# EAGLE design SurfaceEEG_V1.4 (EAGLE 7.7.0)
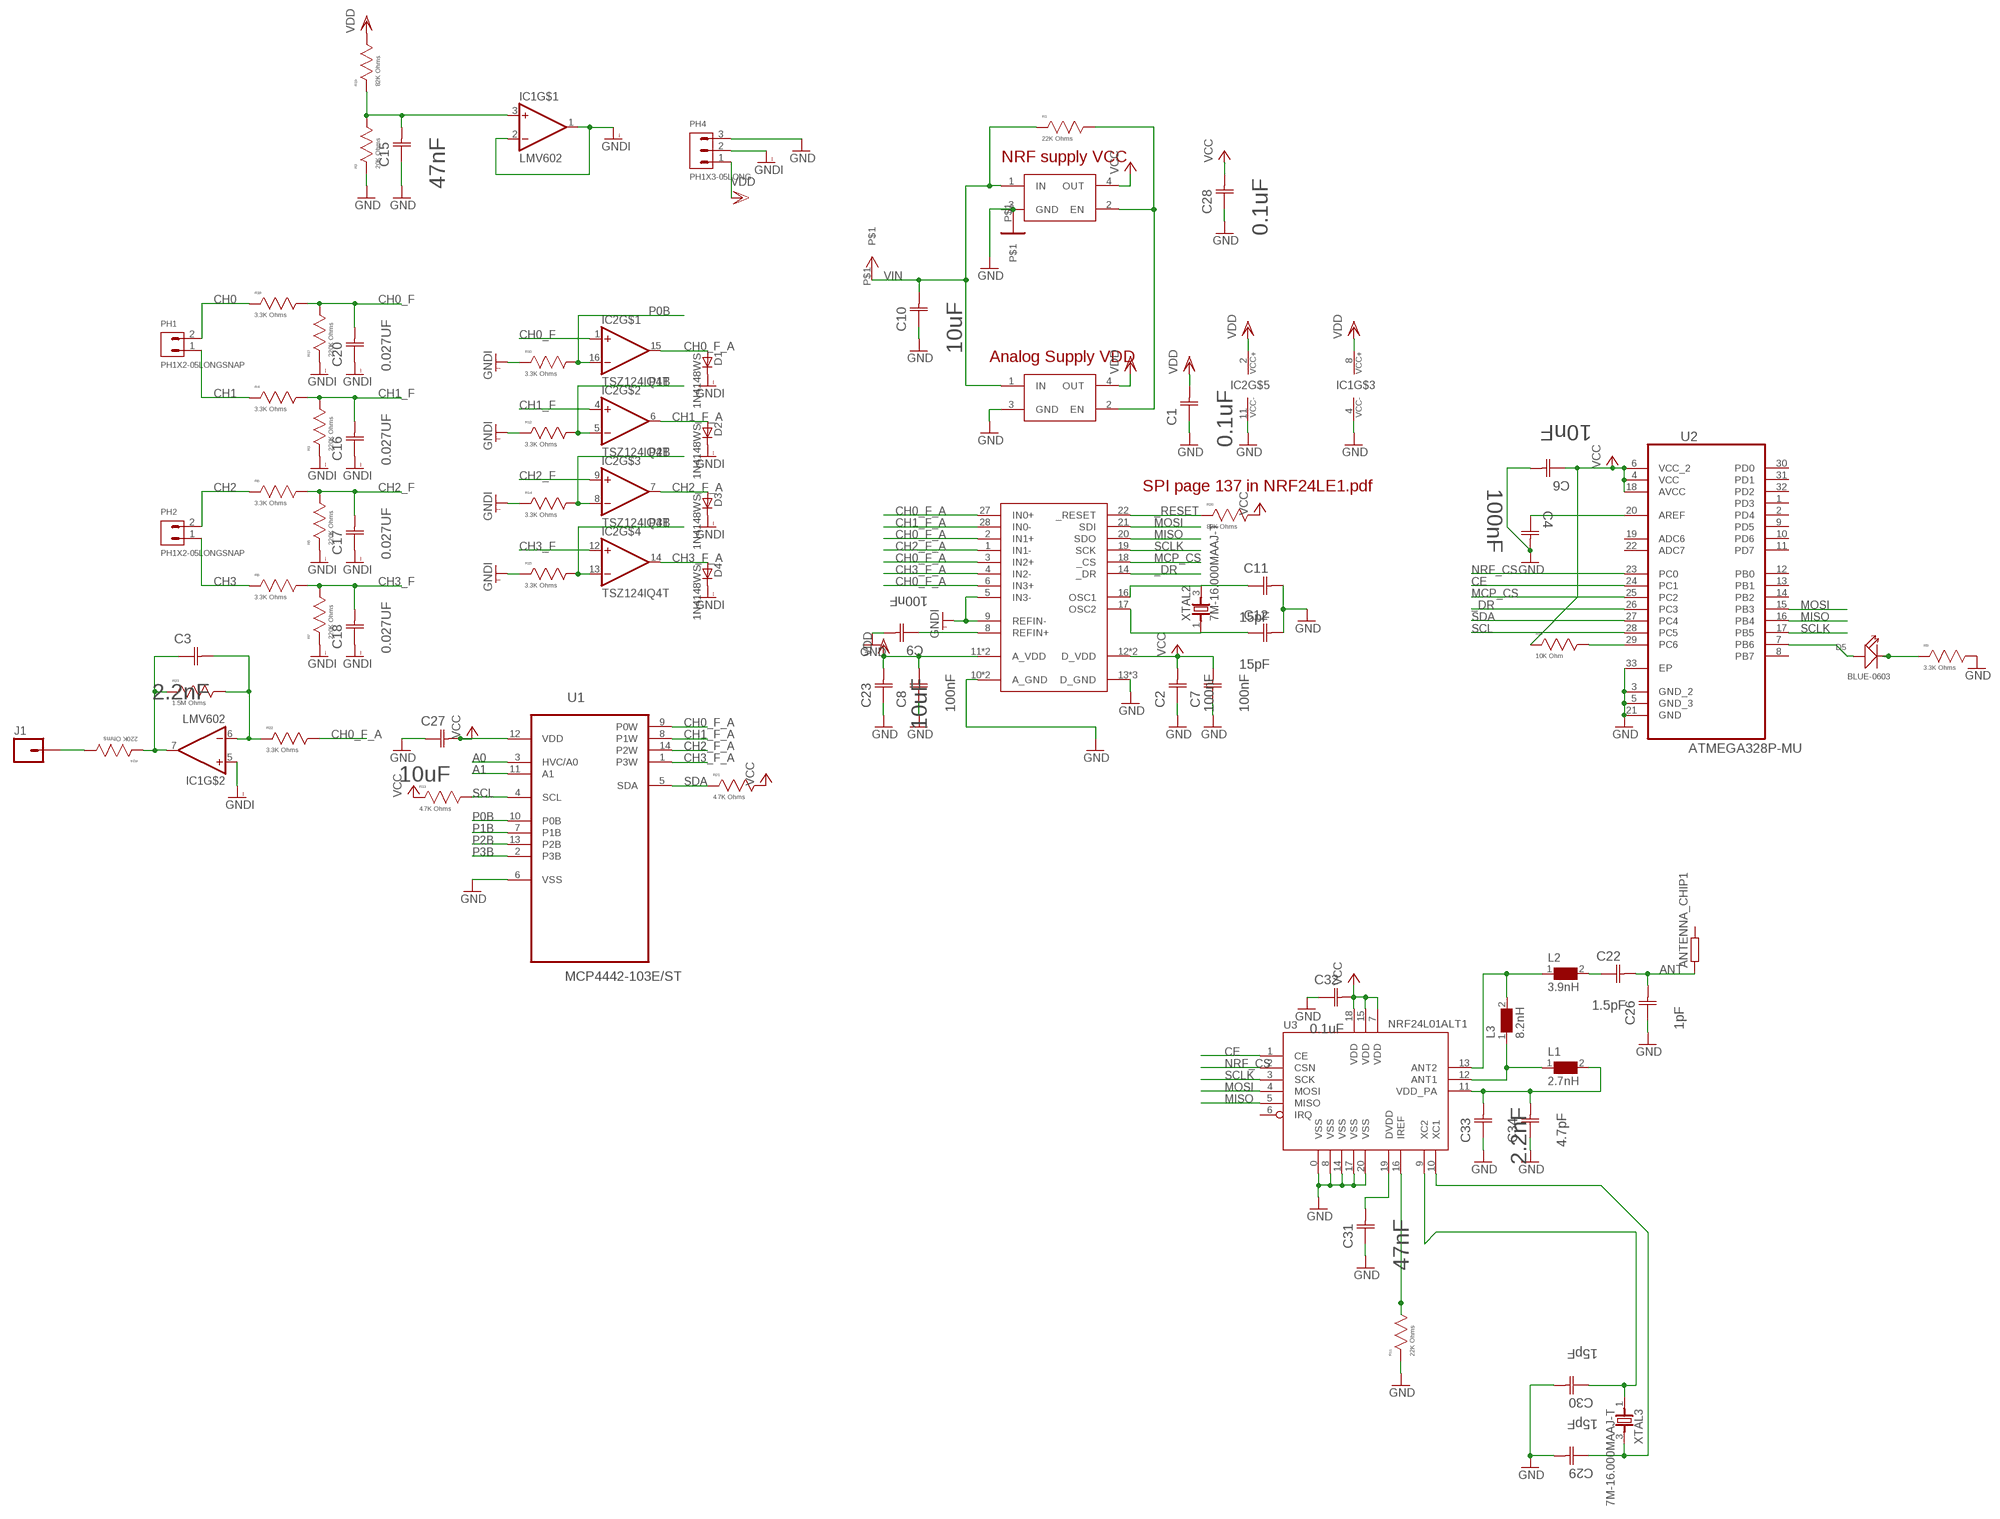
[diagram p0: schematic, sheet 1]

## Parts
ANTENNA_CHIP1  R0805  [R0805]
C1  0.1uF  C0603C104K5RAC-TU  [CAPC1608X85N]
C2  100nF  06033C104JAT2A  [CAPC1608X90N]
C3  2.2nF  C0402C222K5RACTU  [CAPC1005X60N]
C4  100nF  C0603C104K4RACTU  [CAPC1608X85N]
C6  10nF  C0603C103J3GACTU  [CAPC1608X85N]
C7  100nF  06033C104JAT2A  [CAPC1608X90N]
C8  100nF  06033C104JAT2A  [CAPC1608X90N]
C9  100nF  06033C104JAT2A  [CAPC1608X90N]
C10  10uF  C0603C106M9PACTU  [CAPC1608X85N]
C11  15pF  UQCL2A150JAT2A/500  [CAPC1005X60N]
C12  15pF  UQCL2A150JAT2A/500  [CAPC1005X60N]
C15  47nF  C0603C473K1RACTU  [CAPC1608X85N]
C16  0.027UF  0603YC273JAT2A  [CAPC1608X90N]
C17  0.027UF  0603YC273JAT2A  [CAPC1608X90N]
C18  0.027UF  0603YC273JAT2A  [CAPC1608X90N]
C20  0.027UF  0603YC273JAT2A  [CAPC1608X90N]
C22  1.5pF  UQCL2A1R5BAT2A/500  [CAPC1005X60N]
C23  10uF  C0603C106M9PACTU  [CAPC1608X85N]
C26  1pF  UQCL2A1R0BAT2A/500  [CAPC1005X60N]
C27  10uF  C0603C106M9PACTU  [CAPC1608X85N]
C28  0.1uF  C0603C104K5RAC-TU  [CAPC1608X85N]
C29  15pF  UQCL2A150JAT2A/500  [CAPC1005X60N]
C30  15pF  UQCL2A150JAT2A/500  [CAPC1005X60N]
C31  47nF  C0603C473K1RACTU  [CAPC1608X85N]
C32  0.1uF  04023C104KAT2A  [CAPC1005X60N]
C33  2.2nF  C0402C222K5RACTU  [CAPC1005X60N]
C34  4.7pF  UQCL2A4R7CAT2A/500  [CAPC1005X60N]
D1  1N4148WS  [SOD323F]
D2  1N4148WS  [SOD323F]
D3  1N4148WS  [SOD323F]
D4  1N4148WS  [SOD323F]
D5  BLUE-0603  SMD-LED-CLEAR-BLUE(0603)  [LED-0603]
IC1  LMV602  [VSSOP8]
IC2  TSZ124IQ4T  [QFN16]
J1  M01SMD-4.5X1.5  [PAD-1.5X4.5]
L1  2.7nH  WE-KI-744765027A_0402A  [WE-KI_0402A]
L2  3.9nH  WE-KI-744765039A_0402A  [WE-KI_0402A]
L3  8.2nH  WE-KI-744765082A_0402A  [WE-KI_0402A]
PH1  PH1X2-05LONGSNAP  [PHLS005-1-2]
PH2  PH1X2-05LONGSNAP  [PHLS005-1-2]
PH4  PH1X3-05LONG  [PHL005-1-3]
R1  22K Ohms  RC0603FR-0722KL  [RESC1608X60N]
R2  20K Ohms  RC0603FR-0720KL  [RESC1608X60N]
R3  220K Ohms  RC0603FR-07220KL  [RESC1608X60N]
R4  3.3K Ohms  RC0603FR-073K3L  [RESC1608X60N]
R5  220K Ohms  RC0603FR-07220KL  [RESC1608X60N]
R6  3.3K Ohms  RC0603FR-073K3L  [RESC1608X60N]
R7  220K Ohms  RC0603FR-07220KL  [RESC1608X60N]
R8  3.3K Ohms  RC0603FR-073K3L  [RESC1608X60N]
R9  3.3K Ohms  RC0603FR-073K3L  [RESC1608X60N]
R10  3.3K Ohms  RC0603FR-073K3L  [RESC1608X60N]
R11  22K Ohms  RC0603FR-0722KL  [RESC1608X60N]
R12  3.3K Ohms  RC0603FR-073K3L  [RESC1608X60N]
R13  4.7K Ohms  9C04021A4701JLHF3  [RESC1005X40N]
R14  3.3K Ohms  RC0603FR-073K3L  [RESC1608X60N]
R15  3.3K Ohms  RC0603FR-073K3L  [RESC1608X60N]
R16  10K Ohm  9C06031A1002JLHFT  [RESC1608X60N]
R17  220K Ohms  RC0603FR-07220KL  [RESC1608X60N]
R18  3.3K Ohms  RC0603FR-073K3L  [RESC1608X60N]
R19  82K Ohms  RT0603FRE0782KL  [RESC1608X60N]
R20  82K Ohms  RT0603FRE0782KL  [RESC1608X60N]
R21  4.7K Ohms  9C04021A4701JLHF3  [RESC1005X40N]
R22  3.3K Ohms  RC0603FR-073K3L  [RESC1608X60N]
R23  1.5M Ohms  RC0603FR-071M5L  [RESC1608X60N]
R24  220K Ohms  RC0603FR-07220KL  [RESC1608X60N]
U1  MCP4442-103E/ST  [SOP65P640X120-14N]
U2  ATMEGA328P-MU  [QFN50P500X500X100-33N]
U3  NRF24L01ALT1  [QFN20_ALT1]
U$1  NCP103  [UDFN4-1*1]
U$2  NCP103  [UDFN4-1*1]
U$3  MCP3912  [QFN28]
U$4  VCC  [VCC-PAD]
U$5  GND  [GND-PAD]
XTAL2  7M-16.000MAAJ-T  [TXC_7M-16.000MAAJ-T]
XTAL3  7M-16.000MAAJ-T  [TXC_7M-16.000MAAJ-T]

## Nets
_DR: U2.26(PC3) U$3.14(_DR)
_RESET: R20.2(R2) U$3.22(_RESET)
A0: U1.3(HVC/A0)
A1: U1.11(A1)
ANT: ANTENNA_CHIP1.1 C22.1(C2) C26.1(C2)
ANT1: L1.1 L3.1 U3.12(ANT1)
ANT2: L2.1 L3.2 U3.13(ANT2)
CE: U2.24(PC1) U3.1(CE)
CH0: PH1.2 R18.2(R2)
CH0_F: C20.2(C2) IC2.1(IN+) R17.1(R1) R18.1(R1)
CH0_F_A: D1.A IC2.15(OUT) R22.1(R1) U1.9(P0W) U$3.2(IN1+) U$3.3(IN2+) U$3.6(IN3+) U$3.27(IN0+)
CH1: PH1.1 R4.2(R2)
CH1_F: C16.2(C2) IC2.4(IN+) R3.1(R1) R4.1(R1)
CH1_F_A: D2.A IC2.6(OUT) U1.8(P1W) U$3.28(IN0-)
CH2: PH2.2 R6.2(R2)
CH2_F: C17.2(C2) IC2.9(IN+) R5.1(R1) R6.1(R1)
CH2_F_A: D3.A IC2.7(OUT) U1.14(P2W) U$3.1(IN1-)
CH3: PH2.1 R8.2(R2)
CH3_F: C18.2(C2) IC2.12(IN+) R7.1(R1) R8.1(R1)
CH3_F_A: D4.A IC2.14(OUT) U1.1(P3W) U$3.4(IN2-)
GND: C1.1(C1) C2.1(C1) C4.2(C2) C6.2(C2) C7.1(C1) C8.1(C1) C9.2(C2) C10.1(C1) C11.1(C2) C12.1(C2) C15.1(C1) C23.1(C1) C26.2(C1) C27.1(C1) C28.1(C1) C29.1(C2) C30.1(C2) C31.1(C1) C32.2(C1) C33.1(C1) C34.2(C1) IC1.4(VCC-) IC2.11(VCC-) PH4.3 R2.2(R2) R9.1(R1) R11.2(R2) U1.6(VSS) U2.3(GND_2) U2.5(GND_3) U2.21(GND) U2.33(EP) U3.0(VSS) U3.8(VSS) U3.14(VSS) U3.17(VSS) U3.20(VSS) U$1.3(GND) U$2.3(GND) U$3.10(A_GND) U$3.13(D_GND) U$3.15(D_GND) U$3.23(D_GND) U$3.26(A_GND) U$5.P$1
GNDI: C16.1(C1) C17.1(C1) C18.1(C1) C20.1(C1) D1.C D2.C D3.C D4.C IC1.1(OUT) IC1.2(IN-) IC1.5(IN+) PH4.2 R3.2(R2) R5.2(R2) R7.2(R2) R10.2(R2) R12.2(R2) R14.2(R2) R15.2(R2) R17.2(R2) U$3.5(IN3-) U$3.9(REFIN-)
MCP_CS: U2.25(PC2) U$3.18(_CS)
MISO: U2.16(PB4) U3.5(MISO) U$3.20(SDO)
MOSI: U2.15(PB3) U3.4(MOSI) U$3.21(SDI)
N$1: D5.+ U2.7(PB6)
N$2: D5.- R9.2(R2)
N$3: C3.2(C2) IC1.6(IN-) R22.2(R2) R23.1(R1)
N$5: R1.1(R1) U$1.2(EN) U$2.2(EN)
N$6: C3.1(C1) IC1.7(OUT) R23.2(R2) R24.2(R2)
N$7: C4.1(C1) U2.20(AREF)
N$8: C30.2(C1) U3.9(XC2) XTAL3.1
N$9: C29.2(C1) U3.10(XC1) XTAL3.3
N$10: J1.P$1 R24.1(R1)
N$12: C9.1(C1) U$3.8(REFIN+)
N$13: C22.2(C1) L2.2
N$14: C11.2(C1) U$3.16(OSC1) XTAL2.3
N$15: C12.2(C1) U$3.17(OSC2) XTAL2.1
N$16: C33.2(C2) C34.1(C2) L1.2 U3.11(VDD_PA)
N$18: C15.2(C2) IC1.3(IN+) R2.1(R1) R19.2(R2)
N$19: R11.1(R1) U3.16(IREF)
N$20: C31.2(C2) U3.19(DVDD)
NRF_CS: U2.23(PC0) U3.2(CSN)
P0B: IC2.16(IN-) R10.1(R1) U1.10(P0B)
P1B: IC2.5(IN-) R12.1(R1) U1.7(P1B)
P2B: IC2.8(IN-) R14.1(R1) U1.13(P2B)
P3B: IC2.13(IN-) R15.1(R1) U1.2(P3B)
RESET: R16.1(R1) U2.29(PC6)
SCL: R13.1(R1) U1.4(SCL) U2.28(PC5)
SCLK: U2.17(PB5) U3.3(SCK) U$3.19(SCK)
SDA: R21.2(R2) U1.5(SDA) U2.27(PC4)
VCC: C2.2(C2) C6.1(C1) C7.2(C2) C27.2(C2) C28.2(C2) C32.1(C2) R13.2(R2) R16.2(R2) R20.1(R1) R21.1(R1) U1.12(VDD) U2.4(VCC) U2.6(VCC_2) U2.18(AVCC) U3.7(VDD) U3.15(VDD) U3.18(VDD) U$1.4(OUT) U$3.12(D_VDD) U$3.24(D_VDD)
VDD: C1.2(C2) C8.2(C2) C23.2(C2) IC1.8(VCC+) IC2.2(VCC+) PH4.1 R19.1(R1) U$2.4(OUT) U$3.11(A_VDD) U$3.25(A_VDD)
VIN: C10.2(C2) R1.2(R2) U$1.1(IN) U$2.1(IN) U$4.P$1
Unconnected: ANTENNA_CHIP1.2 U2.1(PD3) U2.2(PD4) U2.8(PB7) U2.9(PD5) U2.10(PD6) U2.11(PD7) U2.12(PB0) U2.13(PB1) U2.14(PB2) U2.19(ADC6) U2.22(ADC7) U2.30(PD0) U2.31(PD1) U2.32(PD2) U3.6(IRQ)

## Notes on the sheet
- NRF supply VCC
- Analog Supply VDD
- SPI page 137 in NRF24LE1.pdf

## Library data of the parts
ANTENNA_CHIP1 = ELL-i-Passives:R: Surface Mount Resistor — in standard sizes
C1 C28 = (manufact)-Kemet-element14:C0603C104K5RAC-TU: CAPACITOR, 0603; MPN: C0603C104K5RAC-TU; OC_FARNELL: 1692286; OC_NEWARK: 97H5226; SUPPLIER: Kemet; TOLERANCE: ±10%; VOLTAGERATING: 50V
C2 C7-C9 = (manufact)-capacitors-AVX-element14:06033C104JAT2A: Capacitor 0603; MPN: 06033C104JAT2A; OC_FARNELL: 1740614; OC_NEWARK: 60R6215; SUPPLIER: AVX; TOLERANCE: ±5%; VOLTAGERATING: 25V
C3 C33 = (manufact)-Kemet-element14:C0402C222K5RACTU: CAPACITOR, 0402; MPN: C0402C222K5RACTU; OC_FARNELL: 1414582; OC_NEWARK: 70K9080; SUPPLIER: Kemet; TOLERANCE: ±10%; VOLTAGERATING: 50V
C4 = (manufact)-Kemet-element14:C0603C104K4RACTU: CAPACITOR, 0603; MPN: C0603C104K4RACTU; OC_FARNELL: 1414610; OC_NEWARK: 19C6005; SUPPLIER: Kemet; TOLERANCE: ±10%; VOLTAGERATING: 16V
C6 = (manufact)-Kemet-element14:C0603C103J3GACTU: CAPACITOR, 0603; MPN: C0603C103J3GACTU; OC_FARNELL: 1457729; OC_NEWARK: 58M4429; SUPPLIER: Kemet; TOLERANCE: ±5%; VOLTAGERATING: 25V
C10 C23 C27 = (manufact)-Kemet-element14:C0603C106M9PACTU: CAPACITOR, 0603; MPN: C0603C106M9PACTU; OC_FARNELL: 1288201; OC_NEWARK: 93K5998; SUPPLIER: Kemet; TOLERANCE: ±20%; VOLTAGERATING: 6.3V
C11 C12 C29 C30 = (manufact)-capacitors-AVX-element14:UQCL2A150JAT2A/500: Capacitor 0402; MPN: UQCL2A150JAT2A/500; OC_FARNELL: -; OC_NEWARK: 32T8795; SUPPLIER: AVX; TOLERANCE: ±5%; VOLTAGERATING: 200V
C15 C31 = (manufact)-Kemet-element14:C0603C473K1RACTU: CAPACITOR, 0603; MPN: C0603C473K1RACTU; OC_FARNELL: 1865550; OC_NEWARK: 29T9032; SUPPLIER: KEMET; TOLERANCE: ±10%; VOLTAGERATING: 100V
C16-C18 C20 = (manufact)-capacitors-AVX-element14:0603YC273JAT2A: Capacitor, 0603; MPN: 0603YC273JAT2A; OC_FARNELL: -; OC_NEWARK: 55J2671; SUPPLIER: AVX; TOLERANCE: ±5%; VOLTAGERATING: 16V
C22 = (manufact)-capacitors-AVX-element14:UQCL2A1R5BAT2A/500: Capacitor 0402; MPN: UQCL2A1R5BAT2A/500; OC_FARNELL: -; OC_NEWARK: 32T8784; SUPPLIER: AVX; TOLERANCE: ±.1 pF; VOLTAGERATING: 200V
C26 = (manufact)-capacitors-AVX-element14:UQCL2A1R0BAT2A/500: Capacitor 0402; MPN: UQCL2A1R0BAT2A/500; OC_FARNELL: -; OC_NEWARK: 32T8778; SUPPLIER: AVX; TOLERANCE: ±.1 pF; VOLTAGERATING: 200V
C32 = (manufact)-capacitors-AVX-element14:04023C104KAT2A: Capacitor 0402; MPN: 04023C104KAT2A; OC_FARNELL: 1867948; OC_NEWARK: 37T9047; SUPPLIER: AVX; TOLERANCE: ±10%; VOLTAGERATING: 25V
C34 = (manufact)-capacitors-AVX-element14:UQCL2A4R7CAT2A/500: Capacitor 0402; MPN: UQCL2A4R7CAT2A/500; OC_FARNELL: -; OC_NEWARK: 32T8823; SUPPLIER: AVX; TOLERANCE: ±.25 pF; VOLTAGERATING: 200V
D1-D4 = (misc)-parts-that-we-use:1N4148WS: 1N4148 General Purpose Rectifie SMD-Version of 1N4148 Case: SOD 323 F Author: Dipl.-Ing. FH Rainer Bayer HHN Hochschule Heilbronn, rainer.bayer@hs-heilbronn.de Ingenieurbüro ing-rb, mail@ing-rb.de; MPN: 1N4148WS-7-F
D5 = Seeed-OPL-Diode:SMD-LED-CLEAR-BLUE(0603): 304090045; MPN: 19-217-BHC-ZL1M2RY-3T
IC1 = (custom)-new-components:LMV602: The library has been designed by Richard Magdycz <https://www.facebook.com/groups/eaglecadsoftUK>; MPN: LMV602MM/NOPB
IC2 = (user-cadsoft)-st-microelectronics-tsz12x:TSZ124: The library has been designed by Richard Magdycz <https://www.facebook.com/groups/eaglecadsoftUK>
J1 = SparkFun-Connectors:M01: Header 1 Standard 1-pin 0.1" header. Use with straight break away headers (SKU : PRT-00116), right angle break away headers (PRT-00553), swiss pins (PRT-00743), machine pins (PRT-00117), and female headers (PRT-00115). SMTSO-256-ET is a "flush mount" nut for a 4-40 screw. The older package used to be too tight, and did not allow it to sit properly thru the drill hit. The latest (0.165DIA) fits nice and snug.
L1 = (manufact)-inductors-WE-KI-element14:WE-KI: SMD Wire Wound Ceramic Inductor WE-KI - Wire wound - High thermal stability - Rated current up to 1 A - High Q-factor - High SRF - Inductance tolerances: 5% (2% upon request) -- Especially developed for high frequency applications -- Perfect for applications in telecommunications -- Bluetooth -- Wireless LAN; MPN: 744765027A; OC_FARNELL: 1748703; OC_NEWARK: 34R6062; PACKAGE: IND-0402; SUPPLIER: Wuerth Elektronik
L2 = (manufact)-inductors-WE-KI-element14:WE-KI: SMD Wire Wound Ceramic Inductor WE-KI - Wire wound - High thermal stability - Rated current up to 1 A - High Q-factor - High SRF - Inductance tolerances: 5% (2% upon request) -- Especially developed for high frequency applications -- Perfect for applications in telecommunications -- Bluetooth -- Wireless LAN; MPN: 744765039A; OC_FARNELL: 1748706; OC_NEWARK: 34R6065; PACKAGE: IND-0402; SUPPLIER: Wuerth Elektronik
L3 = (manufact)-inductors-WE-KI-element14:WE-KI: SMD Wire Wound Ceramic Inductor WE-KI - Wire wound - High thermal stability - Rated current up to 1 A - High Q-factor - High SRF - Inductance tolerances: 5% (2% upon request) -- Especially developed for high frequency applications -- Perfect for applications in telecommunications -- Bluetooth -- Wireless LAN; MPN: 744765082A; OC_FARNELL: 1748715; OC_NEWARK: 34R6073; PACKAGE: IND-0402; SUPPLIER: Wuerth Elektronik
PH1 PH2 = pel_hdr:PH1X2
PH4 = (misc)-parts-that-we-use:PH1X3
R1 R11 = (manufact)-resistors-YAGEO-element14:RC0603FR-0722KL: RESISTOR, 0603; MPN: RC0603FR-0722KL; OC_FARNELL: 1117251; OC_NEWARK: 68R0072; SUPPLIER: Yageo; TOLERANCE: ±1%; WATTAGE: 1/10 W
R2 = (manufact)-resistors-YAGEO-element14:RC0603FR-0720KL: RESISTOR, 0603; MPN: RC0603FR-0720KL; OC_FARNELL: 1799331; OC_NEWARK: 05R9835; SUPPLIER: Yageo; TOLERANCE: ±1%; WATTAGE: 1/10 W
R3 R5 R7 R17 R24 = (manufact)-resistors-YAGEO-element14:RC0603FR-07220KL: RESISTOR, 0603; MPN: RC0603FR-07220KL; OC_FARNELL: 1117252; OC_NEWARK: 68R0074; SUPPLIER: Yageo; TOLERANCE: ±1%; WATTAGE: 1/10 W
R4 R6 R8-R10 R12 R14 R15 R18 R22 = (manufact)-resistors-YAGEO-element14:RC0603FR-073K3L: RESISTOR, 0603; MPN: RC0603FR-073K3L; OC_FARNELL: 1117258; OC_NEWARK: 68R0079; SUPPLIER: Yageo; TOLERANCE: ±1%; WATTAGE: 1/10 W
R13 R21 = (manufact)-resistors-YAGEO-element14:9C04021A4701JLHF3: RESISTOR, 0402; MPN: 9C04021A4701JLHF3; OC_FARNELL: -; OC_NEWARK: 37J0268; SUPPLIER: YAGEO; TOLERANCE: ±5%; WATTAGE: 0.0625 W
R16 = (manufact)-resistors-YAGEO-element14:9C06031A1002JLHFT: RESISTOR, 0603; MPN: 9C06031A1002JLHFT; OC_FARNELL: -; OC_NEWARK: 87K3055; SUPPLIER: Yageo; TOLERANCE: ±5%; WATTAGE: 0.1 W
R19 R20 = (manufact)-resistors-YAGEO-element14:RT0603FRE0782KL: RESISTOR, 0603; MPN: RT0603FRE0782KL; OC_FARNELL: 1500658; OC_NEWARK: -; SUPPLIER: Yageo; TOLERANCE: ±1%; WATTAGE: 1/10 W
R23 = (manufact)-resistors-YAGEO-element14:RC0603FR-071M5L: RESISTOR, 0603; MPN: RC0603FR-071M5L; OC_FARNELL: 1117246; OC_NEWARK: 98K7362; SUPPLIER: Yageo; TOLERANCE: ±1%; WATTAGE: 1/10 W
U1 = (manufact)-Microchip-MCP44-farnell:MCP44: 7/8-Bit Quad I2C Digital POT,TSSOP-14; MPN: MCP4442-103E/ST; OC_FARNELL: 1855446; OC_NEWARK: 91R2864; PACKAGE: TSSOP-14; SUPPLIER: MICROCHIP
U2 = (misc)-parts-that-we-use:ATMEGA328P-MU: Programmable Flash; MPN: ATMEGA328P-MU; OC_FARNELL: 1748522; OC_NEWARK: 26R2526; PACKAGE: QFN-32; SUPPLIER: Atmel
U3 = Testing:NRF24L01: 2.4GHz Low Power Transceiver This is the very popular, low cost, very low power RF transceiver from Nordic Semiconductor. Simple SPI interface. SKU: COM-00690
U$1 U$2 = (custom)-new-components:NCP103: NCP103AMX330TCG 3.3V LDO: 75mV dropout, 150 mA http://www.onsemi.com/pub_link/Collateral/NCP103-D.PDF; MPN: NCP103AMX330TCG
U$3 = (custom)-new-components:MCP3912; MPN: MCP3912A1-E/MQ
U$4 = (custom)-new-components:VCC
U$5 = (custom)-new-components:GND
XTAL2 XTAL3 = (misc)-parts-that-we-use:7M-16.000MAAJ-T: CRYSTAL SEAM, 16MHZ, 18PF, SMD; MPN: 7M-16.000MAAJ-T; OC_FARNELL: 1842060; OC_NEWARK: 84R5710; PACKAGE: SMD; SUPPLIER: TXC

## Board
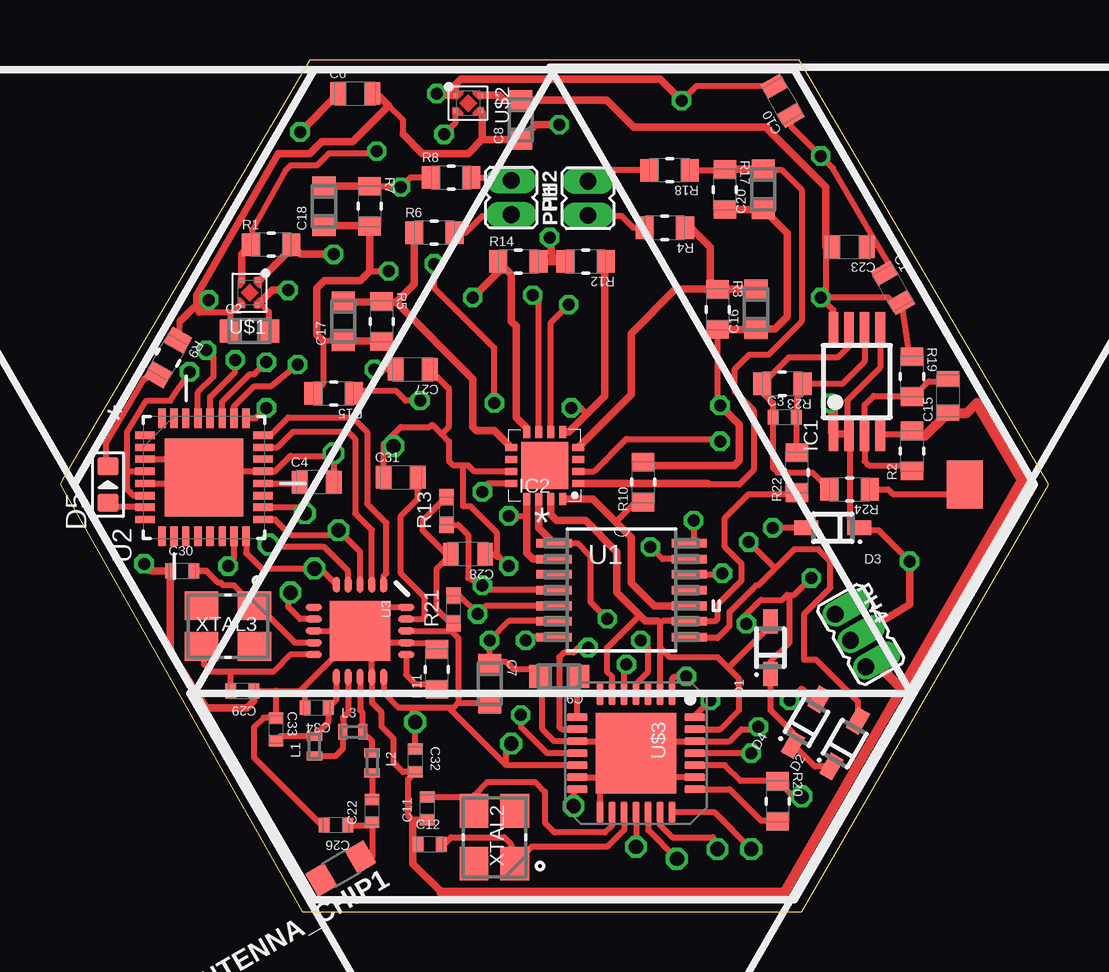
[diagram p1: board, top side]
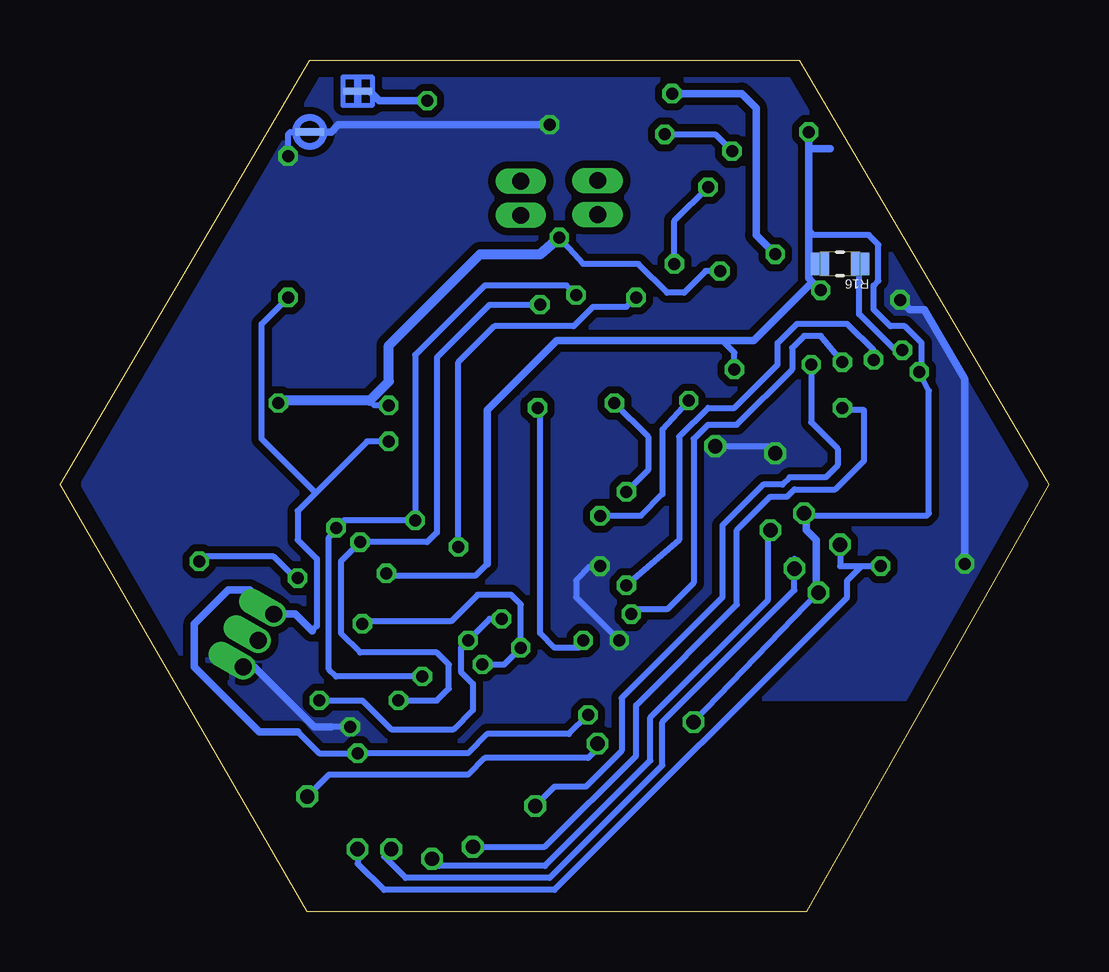
[diagram p2: board, bottom side, seen from below]

Size 41.2 x 35.5 mm. Coordinates in mm from the lower left corner, seen from the top.
Outline: 10.1,0 30.9,0 41.2,17.8 30.8,35.5 10.4,35.5 0.1,18 0,17.8 10.1,0
Copper layers (1*16): Top 0.035mm / dielectric 1.5mm / Bottom 0.035mm
Design rules "rules_Kharkiv *": minimum track width 8mil, minimum drill 15mil, track to track 0.19mm, track to pad 0.19mm, pad to pad 0.19mm, via to via 0.19mm, smd to smd 0.19mm, copper to edge 0.7mm, drill to drill 8mil, minimum pad ring 7mil, minimum via ring 6mil, stop-mask expansion 4mil, vias tented up to drill 0mil, thermal gap 10mil

### Footprints (pad centres in the part's own frame; a part is rotated, then mirrored left to right if it is on the bottom)
R0805 = smd 0.9 x 1.1: 1 -0.95,0; 2 0.95,0
CAPC1608X85N = smd 0.66 x 0.94: 1 -0.711,0; 2 0.711,0
CAPC1608X90N = smd 0.864 x 0.965: 1 -0.813,0; 2 0.813,0
CAPC1005X60N = smd 0.457 x 0.61: 1 -0.483,0; 2 0.483,0
SOD323F = smd 1 x 0.6: A 1.1,0; C -1.1,0
LED-0603 = smd 0.762 x 0.889: + -0.762,0; - 0.762,0
VSSOP8 = smd 1.4 x 0.4: 1 -2.2,0.975; 2 -2.2,0.325; 3 -2.2,-0.325; 4 -2.2,-0.975; 5 2.2,-0.975; 6 2.2,-0.325; 7 2.2,0.325; 8 2.2,0.975
QFN16 = smd 0.5 x 0.3: 1 -1.4,0.75; 2 -1.4,0.25; 3 -1.4,-0.25; 4 -1.4,-0.75; 9 1.4,-0.75; 10 1.4,-0.25; 11 1.4,0.25; 12 1.4,0.75 | smd 0.3 x 0.5: 5 -0.75,-1.4; 6 -0.25,-1.4; 7 0.25,-1.4; 8 0.75,-1.4; 13 0.75,1.4; 14 0.25,1.4; 15 -0.25,1.4; 16 -0.75,1.4 | smd 1.95 x 1.95: EXP 0,0
PAD-1.5X4.5 = smd 1.5 x 2: P$1 0,0
WE-KI_0402A = smd 0.375 x 0.65: 1 -0.412,0; 2 0.412,0
PHLS005-1-2 = drill 0.7 pad 1.016 long: 1 -0.076,0; 2 1.346,0
PHL005-1-3 = drill 0.7 pad 1.016 offset: 1 0,0; 2 1.27,0; 3 2.54,0
RESC1608X60N = smd 0.762 x 0.94: 1 -0.838,0; 2 0.838,0
RESC1005X40N = smd 0.66 x 0.61: 1 -0.584,0; 2 0.584,0
SOP65P640X120-14N = smd 1.473 x 0.356: 1 -2.819,1.956; 2 -2.819,1.295; 3 -2.819,0.66; 4 -2.819,0; 5 -2.819,-0.66; 6 -2.819,-1.295; 7 -2.819,-1.956; 8 2.819,-1.956; 9 2.819,-1.295; 10 2.819,-0.66; 11 2.819,0; 12 2.819,0.66; 13 2.819,1.295; 14 2.819,1.956
QFN50P500X500X100-33N = smd 0.813 x 0.305: 1 -2.464,1.753; 2 -2.464,1.245; 3 -2.464,0.762; 4 -2.464,0.254; 5 -2.464,-0.254; 6 -2.464,-0.762; 7 -2.464,-1.245; 8 -2.464,-1.753; 17 2.464,-1.753; 18 2.464,-1.245; 19 2.464,-0.762; 20 2.464,-0.254; 21 2.464,0.254; 22 2.464,0.762; 23 2.464,1.245; 24 2.464,1.753 | smd 0.305 x 0.813: 9 -1.753,-2.464; 10 -1.245,-2.464; 11 -0.762,-2.464; 12 -0.254,-2.464; 13 0.254,-2.464; 14 0.762,-2.464; 15 1.245,-2.464; 16 1.753,-2.464; 25 1.753,2.464; 26 1.245,2.464; 27 0.762,2.464; 28 0.254,2.464; 29 -0.254,2.464; 30 -0.762,2.464; 31 -1.245,2.464; 32 -1.753,2.464 | smd 3.251 x 3.251: 33 0,0
QFN20_ALT1 = smd 2.515 x 2.515: 0 0,0 | smd 0.686 x 0.293: 1 -1.925,0.986; 2 -1.925,0.493; 3 -1.925,0; 4 -1.925,-0.493; 5 -1.925,-0.986; 11 1.925,-0.986; 12 1.925,-0.493; 13 1.925,0; 14 1.925,0.493; 15 1.925,0.986 | smd 0.293 x 0.686: 6 -0.986,-1.925; 7 -0.493,-1.925; 8 0,-1.925; 9 0.493,-1.925; 10 0.986,-1.925; 16 0.986,1.925; 17 0.493,1.925; 18 0,1.925; 19 -0.493,1.925; 20 -0.986,1.925
UDFN4-1*1 = smd 0.2 x 0.2: 1 -0.325,-0.525; 2 0.325,-0.525; 3 0.325,0.525; 4 -0.325,0.525
QFN28 = smd 0.85 x 0.3: 1 -2.45,1.5; 2 -2.45,1; 3 -2.45,0.5; 4 -2.45,0; 5 -2.45,-0.5; 6 -2.45,-1; 7 -2.45,-1.5; 15 2.45,-1.5; 16 2.45,-1; 17 2.45,-0.5; 18 2.45,0; 19 2.45,0.5; 20 2.45,1; 21 2.45,1.5 | smd 0.3 x 0.85: 8 -1.5,-2.45; 9 -1,-2.45; 10 -0.5,-2.45; 11 0,-2.45; 12 0.5,-2.45; 13 1,-2.45; 14 1.5,-2.45; 22 1.5,2.45; 23 1,2.45; 24 0.5,2.45; 25 0,2.45; 26 -0.5,2.45; 27 -1,2.45; 28 -1.5,2.45 | smd 3.35 x 3.35: M 0,0
VCC-PAD = smd 1.2 x 0.3: P$1 0,0
GND-PAD = smd 1.2 x 0.3: P$1 0,0
TXC_7M-16.000MAAJ-T = smd 1.4 x 1.2: 1 -1.1,-0.85; 2 1.1,-0.85; 3 1.1,0.85; 4 -1.1,0.85

### Placement (x,y rotation side)
ANTENNA_CHIP1  11.7,1.8 210 top
C1  34.7,26 300 top
C2  7.9,24.2 0 top
C3  30.2,20.6 0 top
C4  10.7,17.9 0 top
C6  12.3,34.1 0 top
C7  17.9,9.5 270 top
C8  19.2,33 90 top
C9  20.8,9.8 180 top
C10  30.1,33.8 120 top
C11  15.3,4.3 90 top
C12  15.4,2.8 0 top
C15  37,21.5 90 top
C16  29,25.1 90 top
C17  11.8,24.6 90 top
C18  11,29.4 90 top
C20  29.3,30.1 90 top
C22  13,4.2 90 top
C23  32.9,27.7 180 top
C26  11.5,3.6 180 top
C27  14.7,22.6 180 top
C28  17,14.9 180 top
C29  7.6,9.2 180 top
C30  5.1,14.2 0 top
C31  14.2,18.1 0 top
C32  14.8,6.3 270 top
C33  9,7.6 270 top
C34  10.7,8.5 180 top
D1  29.6,11 90 top
D2  32.7,7 60 top
D3  32.2,16 180 top
D4  31.1,7.9 60 top
D5  2,17.8 90 top
IC1  33.2,22.1 90 top
IC2  20.2,18.6 180 top
J1  37.7,17.8 180 top
L1  10.6,6.9 90 top
L2  13,6.2 270 top
L3  12.2,7.5 0 top
PH1  22,29.1 90 top
PH2  18.8,30.4 270 top
PH4  32.3,12.4 300 top
R1  8.8,27.8 0 top
R2  35.5,19.2 90 top
R3  27.4,25.1 270 top
R4  25.2,28.5 180 top
R5  13.4,24.6 270 top
R6  15.6,28.3 0 top
R7  12.9,29.4 270 top
R8  16.3,30.6 0 top
R9  4.5,23.1 240 top
R10  24.3,17.9 90 top
R11  15.7,10.1 90 top
R12  21.9,27.1 180 top
R13  16.1,16.7 90 top
R14  19.1,27.1 0 top
R15  11.4,21.6 180 top
R16  8.7,27 180 bottom
R17  27.7,30.1 270 top
R18  25.4,30.9 180 top
R19  35.5,22.3 270 top
R20  29.9,4.6 270 top
R21  16.4,12.6 90 top
R22  30.7,18.3 90 top
R23  30.1,22 180 top
R24  32.9,17.6 180 top
U1  23.4,13.4 0 top
U2  6,18.1 0 top
U3  12.5,11.7 270 top
U$1  7.9,25.8 180 top
U$2  17,33.7 270 top
U$3  24,6.6 270 top
U$4  28.8,34.2 0 bottom
U$5  30.8,32.5 0 bottom
XTAL2  18.1,3.1 90 top
XTAL3  7,11.9 180 top

### Tracks (layer width: path | path; a pad name or v marks a point on that pad's centre or on a via)
_DR  (via drill 0.5, 0.6)
  Top 0.254: U2.26 7.25,21.05 8.1,21.9 8.8,21.9 v9.9,22.8 | v21.4,4.4 21.4,4.95 U$3.14
  Bottom 0.254: v9.9,22.8 9.9,20.4 8.8,19.3 8.8,18.6 9.3,18.1 10.8,18.1 11.1,17.8 11.9,17.8 13.6,16.1 13.6,13.1 17.8,8.9 17.8,6.7 19.3,5.2 20.6,5.2 v21.4,4.4
_RESET
  Top 0.254: U$3.22 27.9,5.1 29.2,3.8 29.86,3.8 R20.2
ANT
  Top 0.254: C26.1 12.88,3.6 C22.1 13,2.25 ANTENNA_CHIP1.1
ANT1
  Top 0.254: U3.12 12.01,8.31 11.8,8.1 11.8,7.51 L3.1 11.8,7.49 11.8,6.8 11.49,6.49 L1.1
ANT2
  Top 0.254: U3.13 12.5,8.4 12.6,8.3 12.6,7.51 L3.2 13,7.11 L2.1
CE
  Top 0.254: U3.1 13.49,13.99 13.6,14.1 13.6,16.2 12.8,17 12.8,20 12.2,20.6 9.5,20.6 8.75,19.85 U2.24
CH0
  Top 0.254: R18.2 22.45,30.9 PH1.2
CH0_F
  Top 0.254: C20.2 29.31,30.9 30.1,30.9 30.9,30.1 30.9,24.6 29.5,23.2 28.7,23.2 28.1,22.6 28.1,21.7 28.9,20.9 28.9,18.4 28.3,17.8 27.04,17.8 26.99,17.85 | R18.1 27.66,30.9 R17.1
  Top 0.305: IC2.1 26.99,17.85 | 27.56,30.8 R17.1 29.27,30.94 C20.2
CH0_F_A
  Top 0.254: U$3.3 U$3.2 25,11 | 25,11 25,12.01 | 25,12.01 24.9,12.11 | U$3.6 23,9.8 22.8,10 22.8,11 24.15,12.35 | U$3.27 27.5,7.6 28.3,8.4 28.3,9.7 27.85,10.15 | 27.85,10.15 27.4,10.6 25.4,10.6 25,11 | D1.A 29.6,11.9 27.85,10.15 | 25,12.01 25.1,12.11 U1.9 27.3,12.11 27.3,12.1 27.4,12.2 27.4,12.8 28.4,13.8 28.4,14.5 27.7,15.2 27.7,16.4 28.7,17.4 30.64,17.4 R22.1
  Top 0.305: 24.9,12.11 24.39,12.11 24.15,12.35 23.2,13.3 23.2,15 21.9,16.3 20.7,16.3 20.45,16.55 IC2.15
CH1
  Top 0.254: R4.2 23.9,28.5 23.4,29 22.02,29 PH1.1
CH1_F
  Top 0.305: R4.1 26.3,28.5 27.1,27.7 27.1,26.24 R3.1 | R3.1 28.98,25.94 C16.2 | R3.1 25.64,25.94 23.8,24.1 23.8,21.55 IC2.4
CH1_F_A  (via drill 0.5 pad 0.61)
  Top 0.254: U1.8 26.26,11.4 27.4,11.4 27.9,11.9 27.9,12.5 29,13.6 29.1,13.6 29.8,14.3 | U$3.28 26.45,8.15 v27.1,8.8 | v21.2,25.3 20.45,24.55 IC2.6 | D2.A 33.25,8.75 31.5,10.5 31,10.5 31,12.4 32.1,13.5 32.1,14.6 31.6,15.1 30.6,15.1 29.8,14.3 | v28.7,15.4 29.8,14.3
  Bottom 0.254: v27.1,8.8 25.5,8.8 25,9.3 25,10.3 25.5,10.8 28.7,10.8 29.5,11.6 29.5,14.6 v28.7,15.4 25.9,15.4 25.5,15.8 25.5,23.1 23.3,25.3 v21.2,25.3
CH2
  Top 0.254: R6.2 16.9,28.3 17.6,29 18.75,29 PH2.2
CH2_F
  Top 0.305: C17.2 13.38,25.41 R5.1 13.44,25.4 14,25.4 | IC2.9 18.1,20.05 17.35,20.05 17.2,20.2 17.2,22.2 14,25.4 | R6.1 14.76,26.16 14,25.4
CH2_F_A  (via drill 0.5 pad 0.61)
  Top 0.254: v26.4,16.3 26.4,15.54 U1.14 | U$3.1 25.5,9.7 25.6,9.8 v26.1,9.8 | D3.A v29.7,16 | v19.7,25.7 19.95,25.45 IC2.7
  Bottom 0.254: v19.7,25.7 20.1,26.1 23.5,26.1 26.4,23.2 v26.4,16.3 29.4,16.3 v29.7,16 29.7,15.9 30,15.6 30,10.1 29.7,9.8 v26.1,9.8
CH3
  Top 0.254: R8.2 18.68,30.6 PH2.1
CH3_F  (via drill 0.5 pad 0.61)
  Top 0.254: IC2.12 17.85,17.85 17.85,17.75 v17.6,17.5 | v18.1,21.2 18.1,23.5 15.6,26 v15.6,27 | R8.1 14.6,30.6 v14.2,30.2 14.16,30.24 R7.1
  Top 0.305: R7.1 11.03,30.24 C18.2
  Bottom 0.254: v18.1,21.2 16.7,19.8 16.7,18.4 v17.6,17.5 | v15.6,27 15.6,28.8 v14.2,30.2
CH3_F_A  (via drill 0.5 pad 0.61)
  Top 0.254: U1.1 21.54,15.36 22.1,14.8 22.1,12.9 v22.8,12.2 | U$3.4 24,9.5 24.5,10 24.5,11 v24.2,11.3 | v30.4,8.8 30.9,9.3 31.35,8.85 D4.A
  Top 0.305: IC2.14 19.95,15.99 U1.1
  Bottom 0.254: v30.4,8.8 28.6,8.8 27.4,7.6 24.8,7.6 24,8.4 24,9.5 24.5,10 24.5,11 v24.2,11.3 23.3,12.2 v22.8,12.2
GND  (via drill 0.5, 0.5 pad 0.61, 0.6)
  Top 0.254: IC2.11 17.25,18.35 17,18.6 16.8,18.6 | 16.8,18.6 16.39,18.6 16.2,18.79 16.2,19.6 15.9,19.9 | 15.9,19.9 15.5,20.3 15.4,20.2 14.2,20.2 13.65,19.65 | IC1.4 35.44,19.9 R2.2 | C2.1 6.9,24 6.9,23.9 | U$1.3 7.47,25.28 7.1,24.9 | 7.1,24.9 7.1,24.19 | 7.1,24.19 7.1,24.01 C2.1 | 5.8,25 7,25 7.1,24.9 | C10.1 30.46,32.74 v31.7,31.5 32.2,31 34.01,27.88 | 34.01,27.88 34.6,26.9 34.6,26.87 C1.1 | 16.8,18.6 16.8,16.9 17.1,16.9 18.2,15.8 18.2,14.79 | 15.9,19.9 16.2,20.2 16.2,21.81 C27.1 | 7.1,24.19 C2.1 | C23.1 33.83,27.7 34.01,27.88 | U2.3 5.24,18.86 U2.33 | U2.5 5.75,17.85 U2.33 | U2.33 6.25,18.35 U2.21 8.95,18.35 9.6,19 11.3,19 v11.4,19.1 11.4,17.91 C4.2 11.41,17.81 | 12.99,11.21 U3.17 15.43,11.21 R11.2 | U3.20 13.49,12.69 U3.0 | U3.8 U3.0 | 12.99,11.21 U3.14 13,8.7 13.4,8.3 13.4,7.7 13.9,7.2 13.9,6.2 14.28,5.82 C32.2 14.5,5.52 14.5,4 14.68,3.82 C11.1 14.82,3.82 14.7,3.7 | 12.99,11.21 U3.0 | 9,9.2 C29.1 8.08,8.78 | 9,9.2 10,9.2 | 10,9.2 U3.0 | C34.2 10.22,8.98 10,9.2 | 4.62,10.88 4.6,10.8 | 9,9.2 C33.1 8.48,8.08 8.1,7.7 8.1,6.4 10.9,3.6 C26.2 | C31.1 13.49,19.49 13.65,19.65 | U$3.15 22.5,5.1 23,5.6 | U$3.13 23,5.6 | U$3.23 24.1,5.6 | 24.1,5.6 23,5.6 | 24.1,6.3 24.9,7.1 U$3.26 | 24.1,6.3 24.1,5.6 | 24.1,6.3 23.3,7.1 U$3.10 20.6,7.1 20.1,7.6 20.1,9.69 C9.2 19.8,9.51 19.8,10.1 18.9,10.1 18.6,10.4 17.99,10.4 C7.1 17.9,11.1 17.89,11.11 17.89,11.29 v17.9,11.3 18.7,12.11 U1.6 | 13.65,19.65 13.95,19.65 v13.9,19.4 | 18.2,14.79 18.31,14.79 v18.7,14.4 | C28.1 18.09,14.9 18.2,14.79 | R9.1 5.02,24.62 | 14.3,32.4 14.3,33 13.7,33.6 | 26.5,7.1 27.9,7.1 28.4,7.6 29,7.6 v29.1,7.7
  Top 0.305: 14.3,32.4 15.1,31.6 17,31.6 17.6,32.2 | 17.6,32.2 17.6,33.3 U$2.3 | 17.6,32.2 17.61,32.19 C8.1 19.81,32.8 v20.8,32.8 | 4.6,10.8 6.1,8.5 7.8,8.5 8.08,8.78 | 14.7,3.02 14.7,2 15.9,0.8 | C6.2 13.2,34.1 13.7,33.6 12.2,32.1 10.9,32.1 10.4,31.6 9.1,31.6 5.7,25.7 5.7,25.3 5.85,25.15 | C30.1 4.6,14.2 | 4.5,14.1 4.6,14.2 | 4.6,14.2 4.6,10.9 4.62,10.88 | 4.6,14.2 3.8,14.2 v3.5,14.5 | 5.8,25 6.2,25.4 v6.2,25.5 5.85,25.15 | 5.85,25.15 5.55,25.15 5.02,24.62 | U$3.26 26.5,7.1 | 14.7,3.7 14.7,3.02 | 14.7,3.02 C12.1 | 7.1,24.19 7.1,24
  Top 0.406: 15.9,0.8 30.2,0.8 35.08,9.28 | 35.08,9.28 40.1,18 38.2,21.2 37.79,20.79 C15.1 36.05,19.84 R2.2 | PH4.3 34.16,10.2 35.08,9.28
  Bottom 0.254: v31.7,31.5 31.7,32.4 31.6,32.5 U$5.P$1 | v13.9,19.4 11.7,19.4 v11.4,19.1 | v18.7,14.4 19.1,14.4 19.7,13.8 19.7,13.1 v17.9,11.3 | v29.1,7.7 29.9,7.7
  Bottom 0.305: v20.8,32.8 29.6,32.8 29.9,32.5 U$5.P$1 | v6.2,25.5 5.8,25.1 5.2,25.1 3.5,22.2 v3.5,14.5 | 29.9,7.7 30.6,7.7 33.1,10.2 PH4.3
  pour Bottom (isolate 0.305): 0.7,18 10.6,35 30.5,35 40.5,17.8 30.5,0.6 15.7,0.6 15.7,8.9 5.7,8.9 0.7,17.9
GNDI  (via drill 0.5 pad 0.61)
  Top 0.254: C17.1 11.79,23.8 10.96,23.8 10.96,22 R15.2 | U$3.5 23.5,10.2 v23.6,10.3 | v22,11 21.6,11 21.4,10.8 21,10.8 20.8,10.6 20.8,7.7 20.9,7.6 U$3.9 | 30.3,13.2 30.6,13.2 v31.3,13.9 | 13.16,28.56 12.96,28.56 12.9,28.5 | 12.9,26.7 v13.7,26.7 | D2.C 31.45,6.05 D4.C 30.55,7.45 29.6,8.4 D1.C 29.6,10.4 30.4,11.2 30.4,13.1 30.3,13.2 | v35.4,14.6 34.1,15.9 33.4,15.9 D3.C 32.9,16.4 32.9,19.88 IC1.2 32.8,19.98 32.8,21.3 34.17,22.68 IC1.5 | R3.2 27.4,21.3 27.5,21.2 v27.5,21.1 | 30.3,13.2 30.1,13 29.2,13 28.3,12.1 v28.6,12
  Top 0.305: C17.1 13.38,23.79 R5.2 | R14.2 20.5,27.1 | R7.2 12.88,28.59 C18.1 10.99,28.59 10.7,28.3 | 10.96,23.8 10.7,24.06 10.7,26 11,26.3 12.5,26.3 12.9,26.7 12.9,28.5 R7.2 | R7.2 13.16,28.56 | 20.5,27.3 20.5,27.1 | R17.2 29.27,29.26 C20.1 30.3,28.29 30.3,24.8 29.79,24.29 C16.1 28.98,24.26 | R3.2 28.98,24.26 | 20.5,27.3 20.7,27.1 R12.2 20.5,27.1 | 28.98,24.26 29.04,24.26 29.2,24.1 | R10.2 24.44,18.6 28.1,18.6 28.3,18.8 28.3,20.3 v27.5,21.1 | 20.5,27.3 v20.4,28.1 | v35.4,14.6 35.4,12.8 PH4.2 | IC1.1 IC1.2
  Top 0.406: IC1.1 32.23,21.07 v32.1,21.2
  Bottom 0.254: 23.3,10.3 v23.6,10.3 22.7,10.3 v22,11 22,12.8 22.4,13.2 23.8,13.2 24.9,12.1 28.5,12.1 v28.6,12 | v13.7,26.7 14.3,26.7 15.2,25.8 15.9,25.8 17.1,27 19.4,27 v20.4,28.1 | v31.3,13.9 31.4,13.9 32.3,14.8 35.2,14.8 v35.4,14.6 | v27.5,21.1 28.1,21.1 28.3,21.3
  Bottom 0.406: v20.4,28.1 21.2,27.4 23.7,27.4 27.5,23.6 27.5,22.1 28.3,21.3 32,21.3 v32.1,21.2
MCP_CS  (via drill 0.5, 0.6)
  Top 0.254: U$3.18 v24,2.7 | U2.25 8.16,20.56 v8.6,21
  Bottom 0.254: v24,2.7 21,2.7 17.2,6.5 17.2,8.6 13,12.8 13,15.9 11.6,17.3 10.9,17.3 10.6,17.6 8.9,17.6 7.7,18.8 7.7,20.9 8.5,20.9 v8.6,21
MISO  (via drill 0.6)
  Top 0.254: 10.5,14.3 8.4,14.3 7.75,14.95 U2.16 | 10.5,14.3 v10.6,14.3 | v10.6,14.3 10.84,14.3 U3.5 | U$3.20 25,3.6 25.5,3.1 27.2,3.1 v27.4,2.6 | v10.6,14.3 10.6,14 10.5,14.3
  Bottom 0.254: v27.4,2.6 27.7,2.3 26.8,1.4 20.8,1.4 16.1,6.1 16.1,7.9 10.6,13.4 v10.6,14.3 10.6,14.7
MOSI  (via drill 0.5, 0.6)
  Top 0.254: v7,14.4 7.1,14.6 7.25,14.75 U2.15 | U$3.21 27.25,4.15 v28.8,2.6 | U3.4 12.01,14.19 11,15.2 8.8,15.2 v8.7,15.3
  Bottom 0.254: v8.7,15.3 8.7,14.4 7.8,14.4 | 7.8,14.4 v7,14.4 | v28.8,2.6 28.8,2 27.7,0.9 20.6,0.9 8.4,13.1 8.4,13.8 7.8,14.4
N$1
  Top 0.254: U2.7 2.18,16.86 D5.+
N$2
  Top 0.254: R9.2 3.87,22.37 3.5,22.2 1.9,19.5 1.9,18.66 D5.-
N$3
  Top 0.254: IC1.6 33.52,22.93 32.6,22 R23.1 30.94,21.64 30.7,21.4 30.7,20.62 C3.2 30.7,20.58 R22.2
N$5  (via drill 0.5 pad 0.61)
  Top 0.254: R1.1 8,27.84 8,28.4 9.4,30.9 9.6,31.1 10.7,31.1 11.2,31.6 13.1,31.6 v13.2,31.7 | U$2.2 16.48,32.88 v16,32.4
  Top 0.305: U$1.2 7.57,27.41 R1.1
  Bottom 0.254: v16,32.4 13.9,32.4 v13.2,31.7
N$6
  Top 0.254: IC1.7 32.88,23.57 32.4,23.1 30.36,23.1 R23.2 29.26,21.64 29.7,21.2 29.7,20.62 C3.1 29.7,20.58 29.7,18.5 29.9,18.3 31.36,18.3 R24.2
N$7
  Top 0.254: U2.20 9.94,17.85 C4.1
N$8
  Top 0.254: U3.9 9.79,11.21 8.25,12.75 XTAL3.1 7.25,13.6 6.8,13.6 6.7,13.7 6.6,13.7 6.1,14.2 C30.2 6,14.2
N$9
  Top 0.254: 7.1,10 8.9,10 9.61,10.71 U3.10 | 7.1,10 6.3,10 6,10.3 6,10.95 XTAL3.3 | C29.2 7.12,9.98 7.1,10
N$10
  Top 0.254: R24.1 34.5,17.6 34.7,17.4 37.3,17.4 J1.P$1
N$12
  Top 0.254: U$3.8 21.55,9.74 C9.1
N$13
  Top 0.254: L2.2 C22.2
N$14
  Top 0.254: C11.2 16.67,4.78 XTAL2.3 17.25,4.85 17.8,5.4 19.8,5.4 20.2,5 20.2,3.7 20.6,3.3 22.7,3.3 23,3.6 U$3.16
N$15
  Top 0.254: U$3.17 23.5,3.4 22.8,2.7 19.65,2.7 XTAL2.1 18.8,2.15 18.8,2.8 18.5,3.1 16.3,3.1 16,2.8 C12.2
N$16
  Top 0.254: U3.11 11.51,8.83 C34.1 11.18,7.9 L1.2 9.2,7.31 C33.2
N$18
  Top 0.254: 35.46,18.2 R2.1 35.26,18.6 33.7,18.6 33.52,18.78 IC1.3 33.52,21.12 33.9,21.5 35.46,21.5 R19.2 35.56,21.46 36.2,22.1 36.89,22.1 C15.2
N$19
  Top 0.254: U3.16 14.43,9.88 14.8,9.5 15.46,9.5 R11.1
N$20
  Top 0.254: U3.19 15.09,12.19 15.2,12.3 15.2,13.1 14.2,14.1 14.2,16.5 14.9,17.2 C31.2
NRF_CS
  Top 0.254: U3.2 12.99,15.91 12.3,16.6 12.3,19.7 12,20 9.7,20 9.04,19.35 U2.23
P0B
  Top 0.254: R10.1 23.96,17.06 23.15,16.25
  Top 0.305: IC2.16 22.2,17.2 23.15,16.25 23.8,15.6 23.8,13.7 24.76,12.74 U1.10
P1B  (via drill 0.5 pad 0.61)
  Top 0.254: U1.7 19.54,11.44 v19.4,11.3 | v21.3,21 21.7,21 21.95,20.75
  Top 0.305: IC2.5 21.2,20 21.95,20.75 22.7,21.5 22.7,27.06 R12.1
  Bottom 0.254: v19.4,11.3 19.4,11.2 19.6,11 20.6,11 21.2,11.6 21.2,20.9 v21.3,21
P2B  (via drill 0.5 pad 0.61)
  Top 0.254: U1.13 25.11,14.7 v24.6,15.2
  Top 0.305: v17.2,25.6 18.26,26.66 R14.1 18.8,26.56 18.8,24.6 19,24.4 19,20.6 19.45,20.15 IC2.8
  Bottom 0.254: v24.6,15.2 24.6,22.9 23.1,24.4 19.8,24.4 19,25.2 17.6,25.2 v17.2,25.6
P3B  (via drill 0.5 pad 0.61)
  Top 0.254: v15,21.3 14.4,21.3 14,21.7 12.34,21.7 R15.1 | v18.7,16.5 19.45,16.5
  Top 0.305: IC2.13 19.45,16.5 19.45,14.95 19.7,14.7 U1.2
  Bottom 0.254: v15,21.3 16.1,20.1 16.1,17.4 17,16.5 v18.7,16.5
RESET  (via drill 0.5)
  Top 0.254: U2.29 5.75,21.65 6.4,22.3 6.4,23.1 v6.1,23.4
  Bottom 0.254: v6.1,23.4 6.4,23.4 7.9,24.9 7.9,26.96 R16.1
SCL  (via drill 0.5)
  Top 0.254: U1.4 17.8,13.4 v17.6,13.6 17,13.9 17,15.7 16.58,16.12 R13.1 | U2.28 6.25,21.45 7.3,22.5 v7.3,23
  Bottom 0.254: v17.6,13.6 15.4,15.5 15.4,19.8 14.2,21 13.1,21 11.3,22.8 11.3,23.7 10.5,24.5 8.4,24.5 7.3,23.4 v7.3,23
SCLK  (via drill 0.6)
  Top 0.254: U3.3 12.5,15 v11.6,15.9 11.4,15.7 9.6,15.7 8.95,16.35 U2.17 | U$3.19 24.5,3.4 v25.7,2.2
  Bottom 0.254: v11.6,15.9 11.7,15.8 11.7,13 16.6,8.1 16.6,6.3 21,1.9 25.4,1.9 v25.7,2.2
SDA  (via drill 0.5)
  Top 0.254: U2.27 6.76,21.26 7.9,22.4 8.1,22.4 v8.6,22.9 | U1.5 17.74,12.74 v17.4,12.4 16.62,13.18 R21.2
  Bottom 0.254: v8.6,22.9 9.5,24 10.2,24 10.7,23.5 10.7,22.6 13,20.3 14.2,20.3 14.8,19.7 14.8,13.7 15.9,12.6 17.2,12.6 v17.4,12.4
VCC  (via drill 0.5, 0.5 pad 0.61, 0.6)
  Top 0.254: 9,24 C2.2 8.7,24.01 8.7,25 8.43,25.28 U$1.4 | 3.05,18.35 U2.4 2.85,18.35 2.8,18.3 | U2.6 3.06,17.34 2.8,17.6 2.8,18.3 | 2.8,18.3 2.8,20 3.6,21.3 4.6,21.3 v5.4,22.5 | U3.18 16.3,11.7 | 16.3,11.7 16.6,11.4 16.6,8.7 | 16.6,8.7 16.4,8.5 16.2,8.5 | 16.2,8.5 14.6,8.5 | 14.6,8.5 14.1,8.5 13.49,9.11 U3.15 | U3.7 10.01,12.19 9.5,12.7 v9.6,13.3 | 14.6,8.5 14.8,8.3 v14.8,7.9 C32.1 | 18.6,6.1 16.2,8.5 | U$3.24 27.7,6.1 28.36,5.44 R20.1 30.54,4.8 v30.9,4.8 | U2.18 9.95,16.86 v10.2,16.6 | C7.2 16.61,8.69 16.6,8.7 | U$3.12 18.6,6.1 | 18.6,6.1 18.6,6.8 v18.8,7 | U1.12 27.64,14.06 v27.6,14.1 | R13.2 15.1,16.28 15.1,15.9 16.1,14.9 C28.2 15.7,14.31 15.7,12.6 16.28,12.02 R21.1 16.4,11.8 16.3,11.7 | C27.2 v13.1,22.6
  Top 0.305: v10,32.5 C6.1 | v9.5,25.9 8.85,25.9 U$1.4
  Bottom 0.254: v9.6,13.3 v14.8,7.9 | v10.2,16.6 10.1,16.5 5.1,16.5 5,16.6 5,21.7 v5.4,22.5 | v18.8,7 18.8,6.8 19.2,6.4 23.5,6.4 24.2,5.7 30,5.7 v30.9,4.8 | 23.4,14.5 23.9,14 27.5,14 v27.6,14.1 | R16.2 9.4,27.3 10,26.7 | 5.5,22.5 5.5,22.7 5.3,22.9 5.3,23.7 6,24.4 6.6,24.4 7.3,25.1 7.3,26.1 7.1,26.3 7.1,27.8 7.5,28.2 9.8,28.2 10,28.4 | v13.1,22.6 13.1,23.3 13.6,23.8
  Bottom 0.305: v10,32.5 10,31.8 | 10,31.8 10,28.4 10,26.7 10,26.4 9.85,26.25 | 9.85,26.25 v9.5,25.9 | 23.4,14.5 23.4,20.9 20.5,23.8 13.6,23.8 12.3,23.8 9.85,26.25 | v5.4,22.5 5.5,22.5 | 9.1,31.8 10,31.8 | 10.1,16.5 10.1,15.9 9.7,15.5 9.7,13.4 v9.6,13.3
VDD  (via drill 0.5 pad 0.61)
  Top 0.254: U$3.11 20.3,6.6 19.2,7.7 v19.2,8.2 | v28.8,6.6 U$3.25 | IC2.2 22.25,18.35 23.6,19.7 27.4,19.7 v27.5,19.6 | 35.26,22.9 R19.1 35.36,23.28 C1.2 34.72,25.38 34.5,25.6 v31.7,25.6 | C23.2 31.9,27.7 31.9,25.8 v31.7,25.6 | IC1.8 32.23,25.07 v31.7,25.6
  Top 0.305: U$2.4 18.27,34.02 18.49,33.81 C8.2 22.79,33.81 23.9,32.7 29.4,32.7 31.9,30.2 31.9,27.7
  Bottom 0.254: v27.5,19.6 28.4,19.6 30.55,17.45 | 30.55,17.45 31.3,16.7 31.3,15.5 30.5,14.7 30.5,11.9 30.7,11.7 | 31.3,7.5 30.4,6.6 v28.8,6.6 24.2,6.6 23.4,7.4 20,7.4 v19.2,8.2 | 30.55,17.45 32.8,19.7 32.8,24.5 v31.7,25.6
  Bottom 0.305: 30.7,11.7 31.4,12.4 PH4.1 33.3,13.4 34.2,13.4 35.6,12 35.6,10.2 32.9,7.5 31.3,7.5
VIN  (via drill 0.5 pad 0.61)
  Top 0.254: C10.2 26.52,34.42 v25.9,33.8
  Top 0.305: U$1.1 8.32,26.32 9.64,27.64 R1.2 10.04,27.4 v11.4,27.4 | v15.7,34.1 15.77,34.02 U$2.1 16.48,34.47 16.7,34.7 25,34.7 v25.9,33.8
  Bottom 0.305: v15.7,34.1 12.8,34.1 12.2,33.5 12.2,28.2 v11.4,27.4 | v25.9,33.8 27.9,33.8 28.3,34.2 U$4.P$1